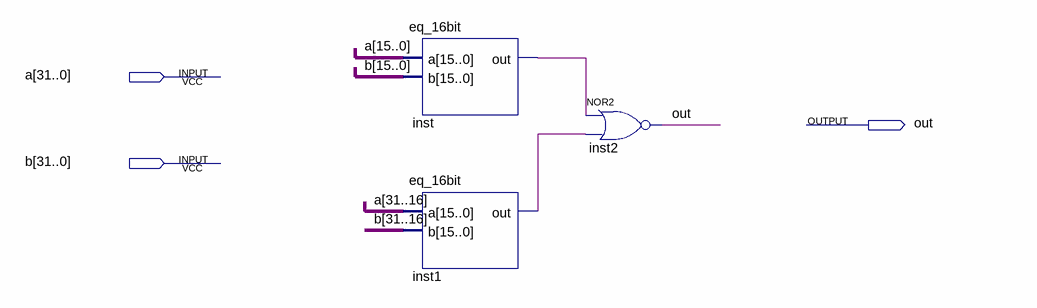
[diagram p0: schematic sheet]
// Quartus schematic eq_32bit.bdf as structural Verilog: 3 symbols, 3 pins
module eq_32bit (
  input  [31:0] a,
  input  [31:0] b,
  output out
);

  wire inst1_out, inst_out;

  eq_16bit inst (.a(a[15:0]), .b(b[15:0]), .out(inst_out));
  eq_16bit inst1 (.a(a[31:16]), .b(b[31:16]), .out(inst1_out));
  nor inst2 (out, inst_out, inst1_out);
endmodule
